# EAGLE design Delay.Chorus PT2399 CTRL (EAGLE 7.7.0)
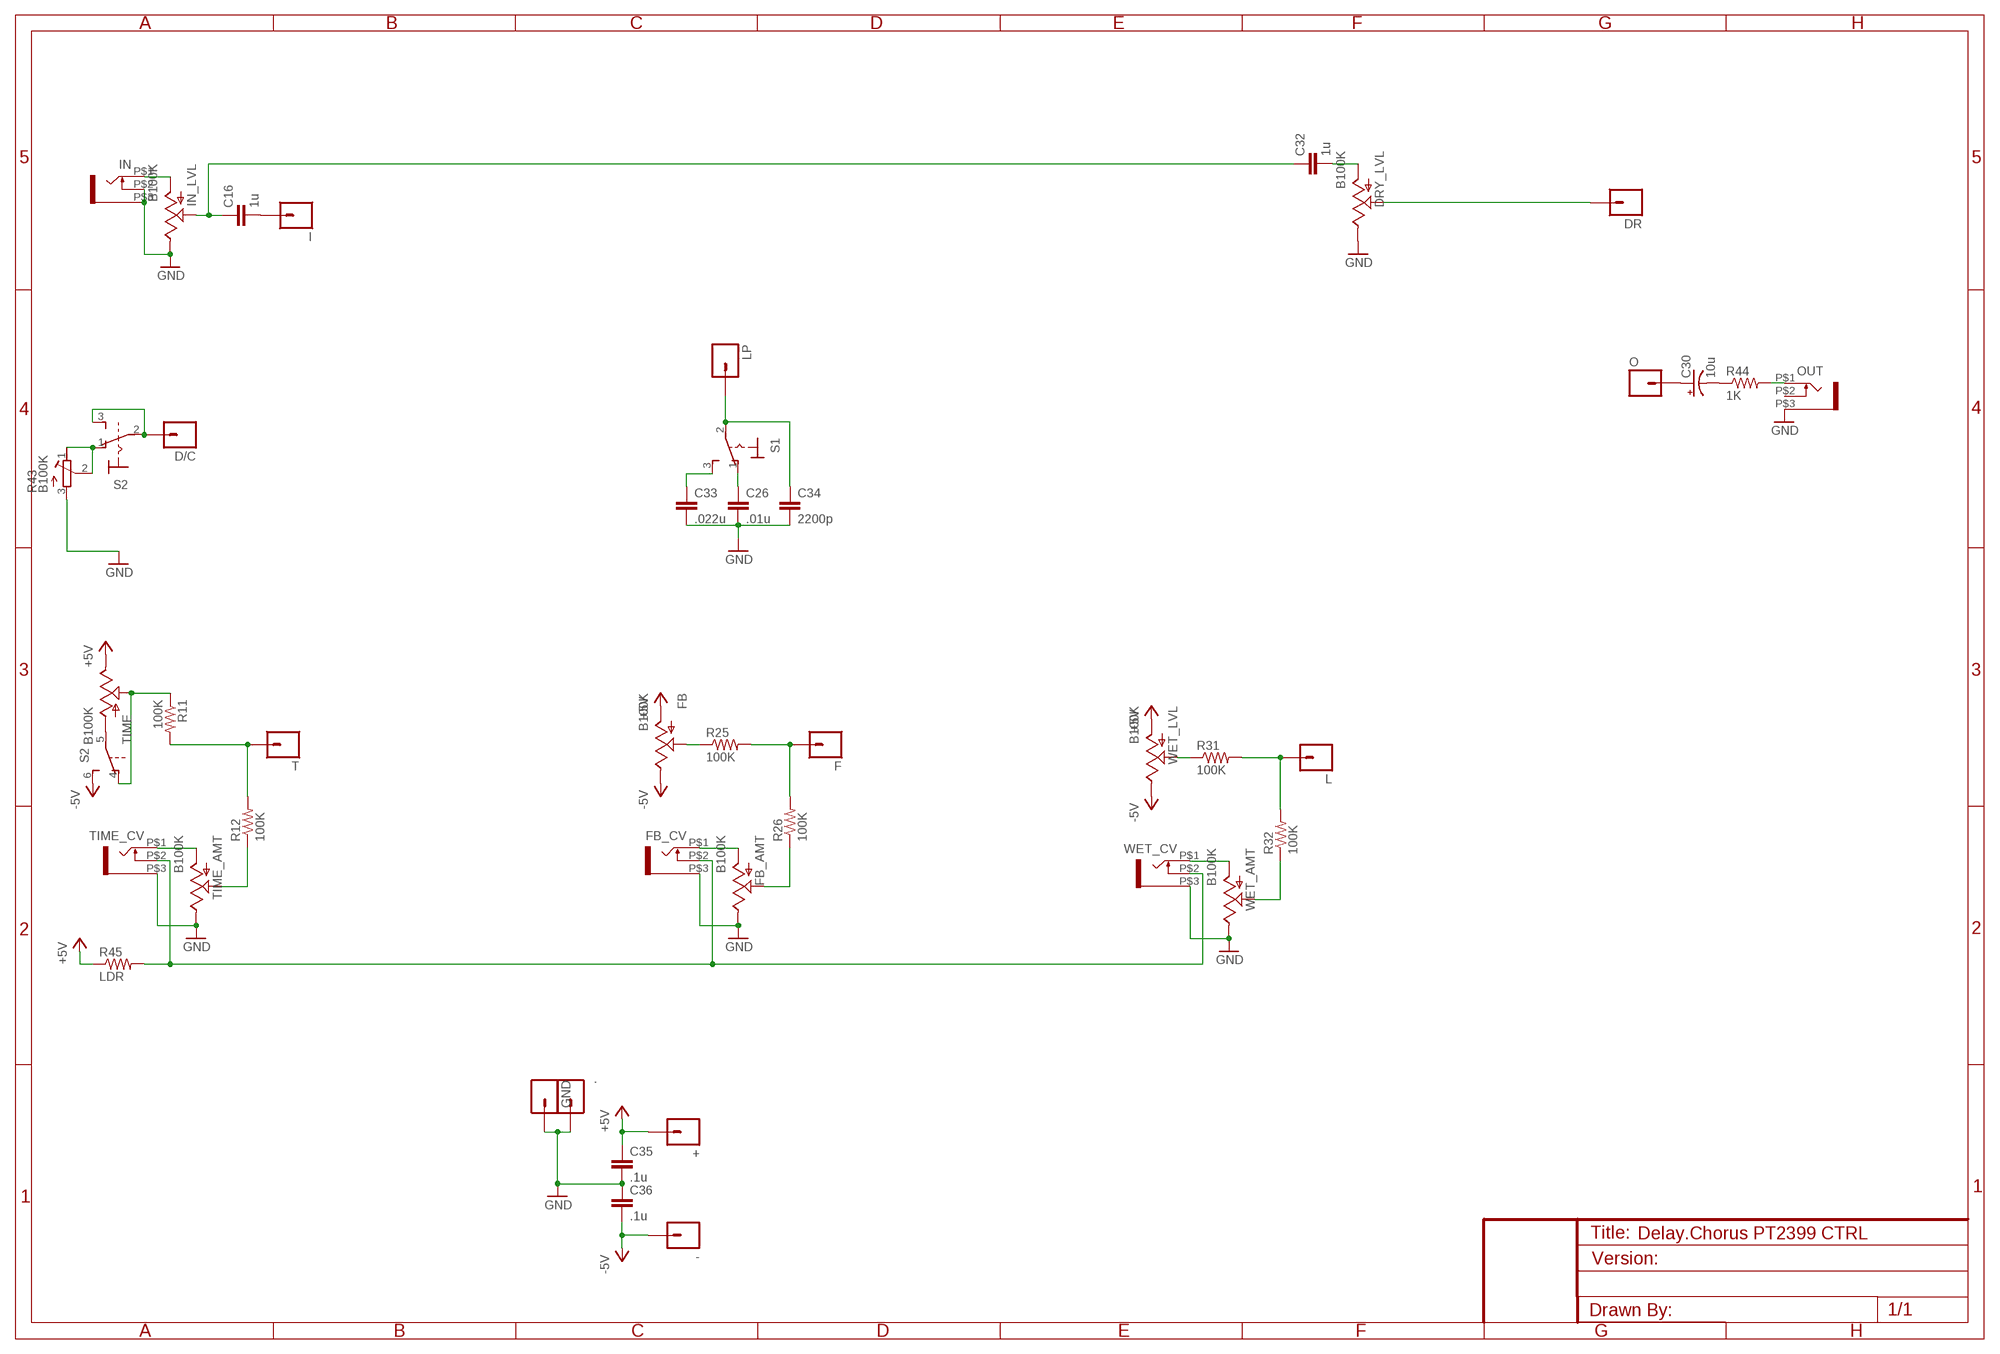
[diagram p0: schematic, sheet 1]

## Parts
+  M01PTH  [1X01]
-  M01PTH  [1X01]
.  M01PTH  [1X01]
C16  1u  CAP1206  [1206]
C26  .01u  C5/2.5  [C5B2.5]
C30  10u  CAP_POLPTH2  [CPOL-RADIAL-10UF-25V]
C32  1u  CAP1206  [1206]
C33  .022u  C5/2.5  [C5B2.5]
C34  2200p  C5/2.5  [C5B2.5]
C35  .1u  CAP0805  [0805]
C36  .1u  CAP0805  [0805]
D/C  M01PTH  [1X01]
DR  M01PTH  [1X01]
DRY_LVL  B100K  POT  [ALPS_POT]
F  M01PTH  [1X01]
FB  B100K  POT  [ALPS_POT]
FB_AMT  B100K  POT  [ALPS_POT]
FB_CV  WQP-PJ301M-12_JACK  [WQP-PJ301M-12_JACK]
GND  M01PTH  [1X01]
I  M01PTH  [1X01]
IN  WQP-PJ301M-12_JACK  [WQP-PJ301M-12_JACK]
IN_LVL  B100K  POT  [ALPS_POT]
L  M01PTH  [1X01]
LP  M01PTH  [1X01]
O  M01PTH  [1X01]
OUT  WQP-PJ301M-12_JACK  [WQP-PJ301M-12_JACK]
R11  100K  RESISTOR0805-RES  [0805]
R12  100K  RESISTOR0805-RES  [0805]
R25  100K  RESISTOR0805-RES  [0805]
R26  100K  RESISTOR0805-RES  [0805]
R31  100K  RESISTOR0805-RES  [0805]
R32  100K  RESISTOR0805-RES  [0805]
R43  B100K  R-TRIMM3314G  [RTRIM3314G]
R44  1K  RESISTOR0805-RES  [0805]
R45  LDR  RESISTORPTH-1/6W  [1/6W-RES]
S1  M9040P  [M9040P]
S2  M9040P2  [M9040P2]
T  M01PTH  [1X01]
TIME  B100K  POT  [ALPS_POT]
TIME_AMT  B100K  POT  [ALPS_POT]
TIME_CV  WQP-PJ301M-12_JACK  [WQP-PJ301M-12_JACK]
WET_AMT  B100K  POT  [ALPS_POT]
WET_CV  WQP-PJ301M-12_JACK  [WQP-PJ301M-12_JACK]
WET_LVL  B100K  POT  [ALPS_POT]

## Nets
+5V: +.1 C35.1 FB.P$3(A) R45.1 TIME.P$1(E) WET_LVL.P$3(A)
-5V: -.1 C36.2 FB.P$1(E) S2.6(2:S) WET_LVL.P$1(E)
GND: ..1 C26.2 C33.2 C34.2 C35.2 C36.1 DRY_LVL.P$1(E) FB_AMT.P$1(E) FB_CV.P$3 GND.1 IN.P$2 IN.P$3 IN_LVL.P$1(E) OUT.P$3 R43.3(A) TIME_AMT.P$1(E) TIME_CV.P$3 WET_AMT.P$1(E) WET_CV.P$3
N$1: D/C.1 S2.2(1:P) S2.3(1:S)
N$2: DR.1 DRY_LVL.P$2(S)
N$3: C30.1(+) O.1
N$4: S2.5(2:P) TIME.P$3(A)
N$5: C30.2(-) R44.1
N$6: OUT.P$1 R44.2
N$14: IN.P$1 IN_LVL.P$3(A)
N$15: C16.1 C32.1 IN_LVL.P$2(S)
N$16: C16.2 I.1
N$20: TIME_AMT.P$3(A) TIME_CV.P$1
N$21: R12.1 TIME_AMT.P$2(S)
N$22: R11.1 S2.4(2:O) TIME.P$2(S)
N$23: R11.2 R12.2 T.1
N$33: FB_AMT.P$3(A) FB_CV.P$1
N$35: FB_AMT.P$2(S) R26.1
N$36: FB.P$2(S) R25.1
N$37: F.1 R25.2 R26.2
N$43: WET_AMT.P$3(A) WET_CV.P$1
N$44: R32.1 WET_AMT.P$2(S)
N$45: R31.1 WET_LVL.P$2(S)
N$46: L.1 R31.2 R32.2
N$57: C32.2 DRY_LVL.P$3(A)
N$60: C26.1 S1.1(O)
N$61: C33.1 S1.3(S)
N$62: C34.1 LP.1 S1.2(P)
N$63: R43.1(E) R43.2(S) S2.1(1:O)
N$65: FB_CV.P$2 R45.2 TIME_CV.P$2 WET_CV.P$2
Unconnected: OUT.P$2

## Library data of the parts
+ - . D/C DR F GND I L LP O T = SparkFun-Connectors:M01: Header 1 Standard 1-pin 0.1" header. Use with straight break away headers (SKU : PRT-00116), right angle break away headers (PRT-00553), swiss pins (PRT-00743), machine pins (PRT-00117), and female headers (PRT-00115).
C16 C32 C35 C36 = SparkFun-Capacitors:CAP: Capacitor Standard 0603 ceramic capacitor, and 0.1" leaded capacitor.
C26 C33 C34 = capacitor-wima:C: CAPACITOR naming: grid - package width
C30 = SparkFun-Capacitors:CAP_POL: Capacitor Polarized These are standard SMD and PTH capacitors. Normally 10uF, 47uF, and 100uF in electrolytic and tantalum varieties. Always verify the external diameter of the through hole cap, it varies with capacity, voltage, and manufacturer. The EIA devices should be standard.
DRY_LVL FB FB_AMT IN_LVL TIME TIME_AMT WET_AMT WET_LVL = SparkFun-Electromechanical:POT; PROD_ID: RES-09177
FB_CV IN OUT TIME_CV WET_CV = thonkiconn:WQP-PJ301M-12_JACK
R11 R12 R25 R26 R31 R32 R44 R45 = SparkFun-Passives:RESISTOR: Resistor Basic schematic elements and footprints for 0603, 1206, and PTH resistors.
R43 = resistor:R-TRIMM: Trimm resistor
S1 = switch:M9040P: TOGGLE SWITCH Marquardt
S2 = switch:M9040P2: TOGGLE SWITCH Marquardt

## Board
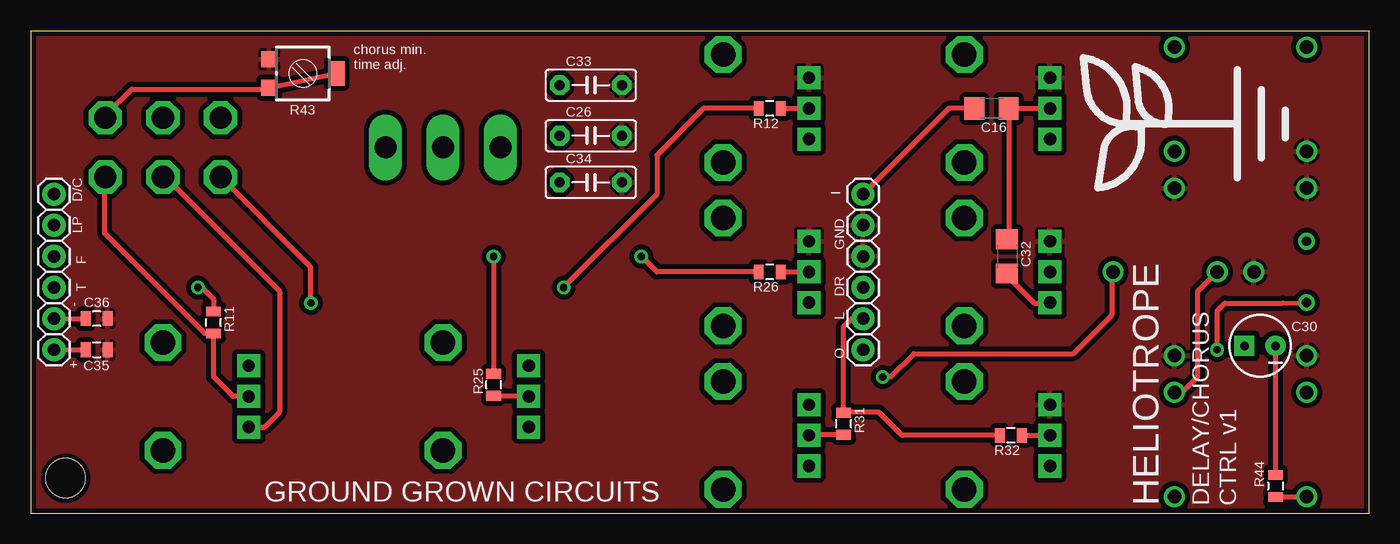
[diagram p1: board, top side]
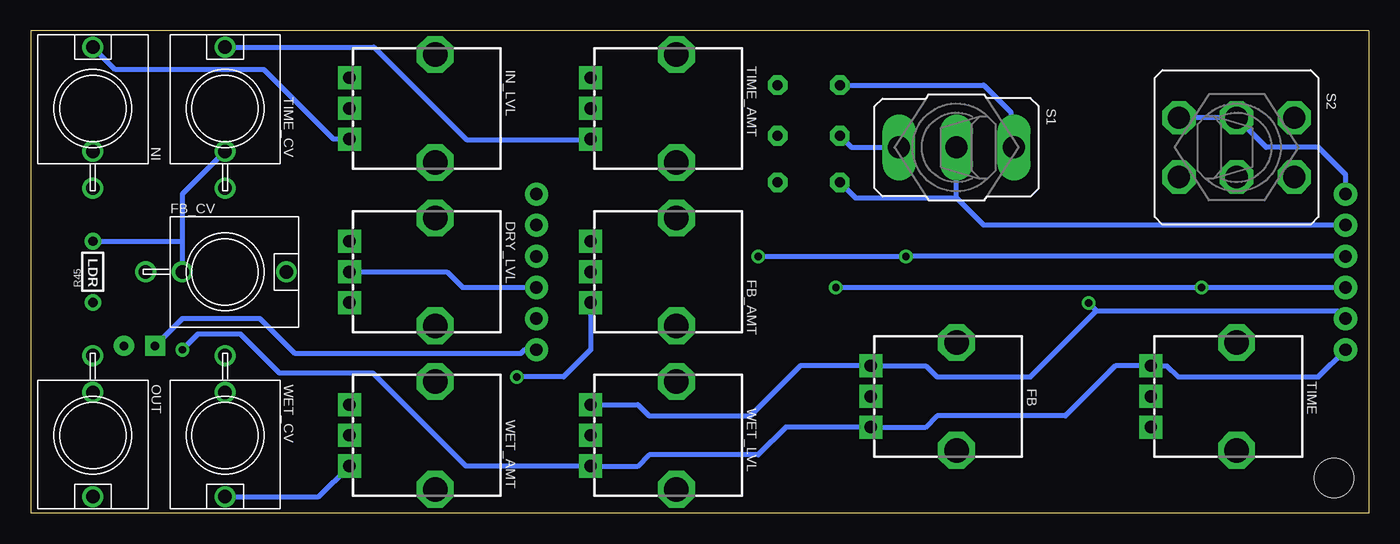
[diagram p2: board, bottom side, seen from below]

Size 109.22 x 39.37 mm. Coordinates in mm from the lower left corner, seen from the top.
Outline: 0,0 109.22,0 109.22,39.37 0,39.37 0,0
Copper layers (1*16): Top 0.035mm / dielectric 1.5mm / Bottom 0.035mm
Design rules "SparkFun": minimum track width 8mil, minimum drill 20mil, track to track 8mil, track to pad 8mil, pad to pad 8mil, via to via 8mil, smd to smd 8mil, copper to edge 8mil, drill to drill 8mil, minimum pad ring 12mil, minimum via ring 10mil, stop-mask expansion 4mil, vias tented up to drill 20mil, thermal gap 10mil
Holes 3.2 mm at 2.86,2.86

### Footprints (pad centres in the part's own frame; a part is rotated, then mirrored left to right if it is on the bottom)
1X01 = drill 1.016 pad 1.88: 1 0,0
1206 = smd 1.6 x 1.8: 1 -1.4,0; 2 1.4,0
C5B2.5 = drill 0.813 pad 1.6 octagon: 1 -2.54,0; 2 2.54,0
CPOL-RADIAL-10UF-25V = drill 0.7 pad 1.651 square: 1 1.27,0 | drill 0.7 pad 1.651: 2 -1.27,0
0805 = smd 0.8 x 1.2: 1 -0.9,0; 2 0.9,0
ALPS_POT = drill 1 pad 1.88 square: P$1 7,-2.5; P$2 7,0; P$3 7,2.5 | drill 2 octagon: P$4 0,-4.4; P$5 0,4.4
WQP-PJ301M-12_JACK = drill 1.1: P$1 0,5; P$2 0,-3.5; P$3 0,-6.5
RTRIM3314G = smd 1.3 x 1.3: 1 1.15,-2.75; 3 -1.15,-2.75 | smd 2 x 1.3: 2 0,2.75
1/6W-RES = drill 0.762: 1 -2.5,0; 2 2.5,0
M9040P = drill 1.803 long: 1 0,4.699; 2 0,0; 3 0,-4.699
M9040P2 = drill 1.803 octagon: 1 -2.413,4.699; 2 -2.413,0; 3 -2.413,-4.699; 4 2.413,4.699; 5 2.413,0; 6 2.413,-4.699

### Placement (x,y rotation side)
+  1.91,13.34 270 top
-  1.91,15.88 270 top
.  67.94,20.95 90 top
C16  78.42,33.02 180 top
C26  45.72,30.8 0 top
C30  100.33,13.65 180 top
C32  79.69,20.95 270 top
C33  45.72,34.92 0 top
C34  45.72,26.99 0 top
C35  5.4,13.34 0 top
C36  5.4,15.88 180 top
D/C  1.91,26.04 270 top
DR  67.94,18.41 90 top
DRY_LVL  76.2,19.68 180 bottom
F  1.91,20.95 270 top
FB  33.66,9.53 180 bottom
FB_AMT  56.52,19.68 180 bottom
FB_CV  93.34,19.68 270 bottom
GND  67.94,23.5 90 top
I  67.94,26.04 90 top
IN  104.14,33.02 0 bottom
IN_LVL  76.2,33.02 180 bottom
L  67.94,15.88 90 top
LP  1.91,23.5 270 top
O  67.94,13.34 90 top
OUT  104.14,6.35 180 bottom
R11  14.92,15.56 90 top
R12  60.33,33.02 180 top
R25  37.78,10.48 90 top
R26  60.33,19.68 180 top
R31  66.36,7.3 90 top
R32  80.01,6.35 180 top
R43  22.23,35.88 270 top
R44  101.6,2.22 270 top
R45  104.14,19.68 90 bottom
S1  33.66,29.84 90 bottom
S2  10.79,29.84 270 bottom
T  1.91,18.41 270 top
TIME  10.79,9.53 180 bottom
TIME_AMT  56.52,33.02 180 bottom
TIME_CV  93.34,33.02 0 bottom
U$1  [LOGO_LARGE]  98.42,31.75 90 top
WET_AMT  76.2,6.35 180 bottom
WET_CV  93.34,6.35 180 bottom
WET_LVL  56.52,6.35 180 bottom

### Tracks (layer width: path | path; a pad name or v marks a point on that pad's centre or on a via)
+5V  (via drill 0.6)
  Top 0.406: +.1 C35.1 | R45.1 102.19,17.14 97.47,17.14 96.84,16.51 v96.84,13.34
  Bottom 0.406: +.1 4.13,11.11 15.56,11.11 16.47,12.03 TIME.P$1 20.68,12.03 24.77,7.94 35.24,7.94 36.2,6.99 40.62,6.99 FB.P$3 47.59,7.03 49.85,4.76 58.74,4.76 59.69,3.81 63.48,3.81 WET_LVL.P$3 73.7,3.85 81.28,11.43 88.9,11.43 92.08,14.61 95.57,14.61 v96.84,13.34
-5V  (via drill 0.6)
  Top 0.406: -.1 C36.2 | v22.86,17.14 22.86,20.07 S2.6
  Bottom 0.406: WET_LVL.P$1 59.65,8.85 58.74,7.94 50.48,7.94 46.35,12.06 40.7,12.06 FB.P$1 36.16,12.03 35.24,11.11 27.62,11.11 22.23,16.51 | 22.23,16.51 2.54,16.51 -.1 | 22.23,16.51 v22.86,17.14
GND
  pour Top (isolate 0.406): 0,0 109.22,0 109.22,39.37 0,39.37
N$1
  Bottom 0.406: D/C.1 1.91,27.62 4.13,29.84 8.38,29.84 S2.2 S2.3
N$2
  Bottom 0.406: DRY_LVL.P$2 75.25,19.68 73.98,18.41 DR.1
N$3
  Bottom 0.406: O.1 68.9,13.34 69.22,13.02 87.63,13.02 90.49,15.88 96.84,15.88 C30.1
N$4
  Top 0.406: S2.5 10.99,27.43 20.32,18.1 20.32,8.26 19.05,6.99 17.84,6.99 TIME.P$3
N$5
  Top 0.406: C30.2 R44.1
N$6
  Top 0.406: R44.2 104.17,1.32 OUT.P$1
N$14
  Bottom 0.406: IN_LVL.P$3 84.5,30.52 90.17,36.2 102.31,36.2 IN.P$1
N$15
  Top 0.406: IN_LVL.P$2 C16.1 79.82,22.48 C32.1
N$16
  Top 0.406: C16.2 74.93,33.02 I.1
N$20
  Bottom 0.406: TIME_CV.P$1 81.2,38.02 73.66,30.48 63.55,30.48 TIME_AMT.P$3
N$21
  Top 0.406: R12.1 TIME_AMT.P$2
N$22
  Top 0.406: TIME.P$2 16.51,9.53 14.92,11.11 R11.1 14.23,14.66 6.03,22.86 6.03,27.37 S2.4
N$23  (via drill 0.6)
  Top 0.406: v13.65,18.41 13.97,18.41 14.92,17.46 R11.2 | R12.2 54.93,33.02 51.12,29.21 51.12,26.04 v43.5,18.41
  Bottom 0.406: T.1 v13.65,18.41 v43.5,18.41
N$33  (via drill 0.6)
  Top 0.406: v69.53,11.11 70.17,11.11 72.07,13.02 85.09,13.02 88.27,16.19 88.27,19.61 FB_CV.P$1
  Bottom 0.406: FB_AMT.P$3 63.52,13.32 65.72,11.11 v69.53,11.11
N$35
  Top 0.406: R26.1 FB_AMT.P$2
N$36
  Top 0.406: R25.1 40.6,9.58 FB.P$2
N$37  (via drill 0.6)
  Top 0.406: v37.78,20.95 R25.2 | R26.2 51.12,19.68 v49.85,20.95
  Bottom 0.406: F.1 v37.78,20.95 v49.85,20.95
N$43
  Bottom 0.406: WET_CV.P$1 85.7,1.35 WET_AMT.P$3
N$44
  Top 0.406: R32.1 WET_AMT.P$2
N$45
  Top 0.406: R31.1 63.57,6.4 WET_LVL.P$2
N$46
  Top 0.406: L.1 66.99,15.88 66.36,15.24 R31.2 66.41,8.26 69.22,8.26 71.12,6.35 R32.2
N$57
  Top 0.406: C32.2 79.69,19.37 81.92,17.14 83.16,17.14 DRY_LVL.P$3
N$60
  Bottom 0.406: C26.1 42.23,29.84 S1.1
N$61
  Bottom 0.406: C33.1 31.43,34.92 29.21,32.7 29.21,30.1 S1.3
N$62
  Bottom 0.406: LP.1 31.43,23.5 33.66,25.72 | 33.66,25.72 S1.2 | C34.1 41.91,25.72 33.66,25.72
N$63
  Top 0.406: S2.1 6.1,32.45 8.26,34.61 19.36,34.61 R43.1 R43.2
N$65
  Top 0.406: WET_CV.P$2 93.99,9.85 95.25,11.11 95.25,18.09 FB_CV.P$2
  Bottom 0.406: R45.2 96.88,22.18 96.84,22.23 | 96.84,22.23 96.84,19.69 FB_CV.P$2 | TIME_CV.P$2 93.35,29.52 96.84,26.04 96.84,22.23

### Text on the board
tPlace: chorus min. / time adj. | GROUND GROWN CIRCUITS | HELIOTROPE | DELAY/CHORUS | CTRL v1